# EasyEDA Pro project coildriver.eprj, board PCB1
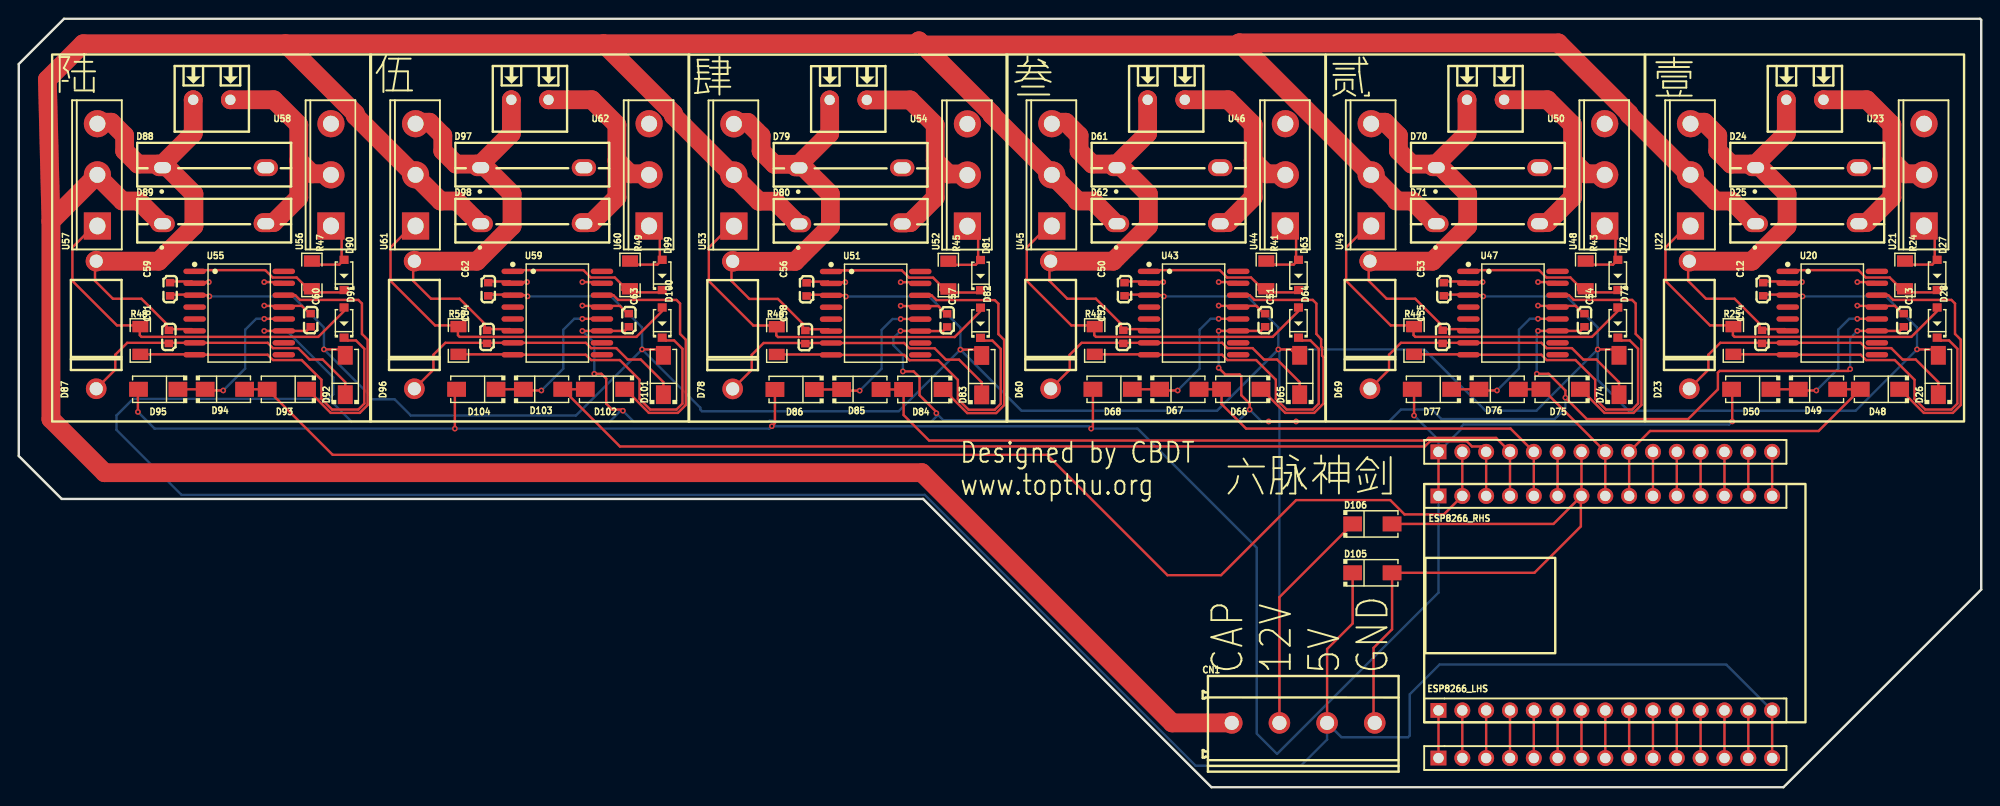
[diagram p2: board, top side]
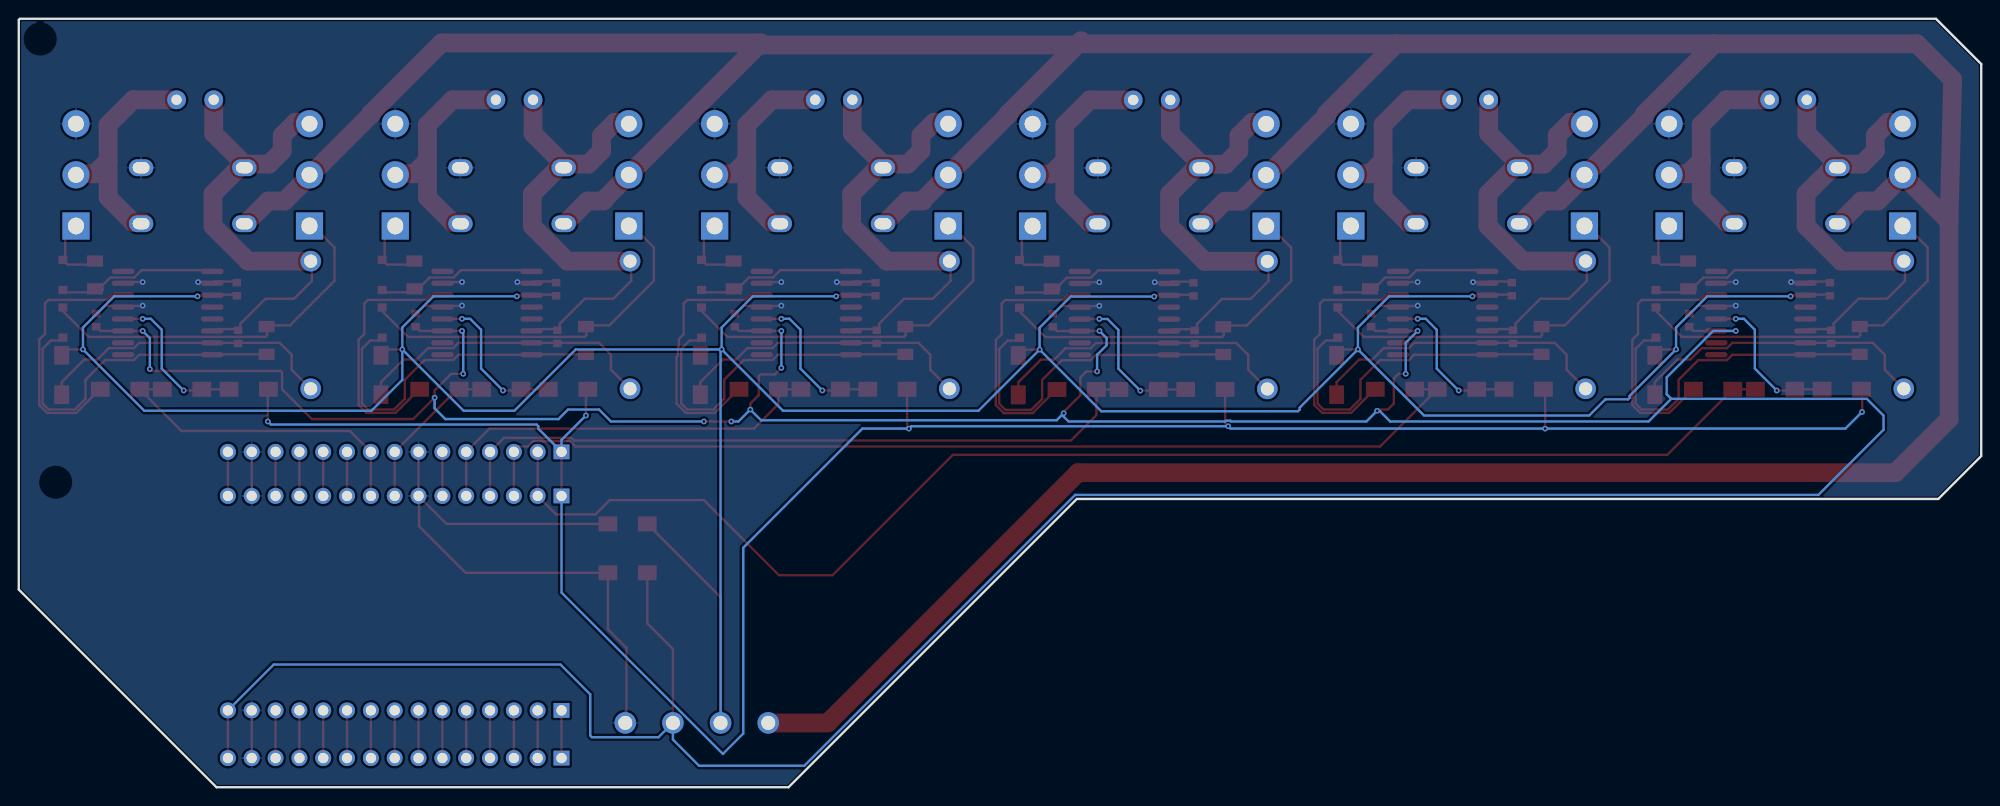
[diagram p3: board, bottom side, seen from below]

Outline 209.17 x 81.92 mm; copper layers: Top Layer, Bottom Layer. Coordinates in mm from the lower left corner of the outline.
Outline path: 0,77.09 0,35.31 4.57,30.73 96.39,30.73 127.13,0 188.09,0 209.17,21.08 209.17,81.79 209.04,81.92 4.83,81.92 0,77.09
Stack: Top Layer 0.035mm / Dielectric1 1.51mm FR4 er 4.5 / Bottom Layer 0.035mm

## Design rules (mm)
template: JLCPCB Capability(Two Layers Board)
spacing copperThickness1oz (default): track to track 0.102, other pairs 0.152 to 0.3
spacing copperThickness2oz: track to track 0.203, other pairs 0.152 to 0.3
track width copperThickness1oz (default): min 0.127, default 0.254, max 2.54
track width copperThickness2oz: min 0.203, default 0.254, max 2.54
differential pair differentialPair (default): width min 0.127, default 0.254, max 2.54; gap min 0.152, default 0.152
via viaSize (default): diameter min 0.5, default 0.61, max 10; hole min 0.3, default 0.305, max 6.3

## Placement (name value [footprint] x y rotation side)
C12  1uF  [C0603]  185.93 53.09 270 top
C13  1uF  [C0603]  200.91 49.78 270 top
C14  22uF  [C0603]  185.8 48.01 90 top
C50  1uF  [C0603]  117.86 53.09 270 top
C51  1uF  [C0603]  132.84 49.78 270 top
C52  22uF  [C0603]  117.73 48.01 90 top
C53  1uF  [C0603]  151.89 53.09 270 top
C54  1uF  [C0603]  166.88 49.78 270 top
C55  22uF  [C0603]  151.76 48.01 90 top
C56  1uF  [C0603]  83.97 53.07 270 top
C57  1uF  [C0603]  98.95 49.77 270 top
C58  22uF  [C0603]  83.84 47.99 90 top
C59  1uF  [C0603]  16.13 53.09 270 top
C60  1uF  [C0603]  31.12 49.78 270 top
C61  22uF  [C0603]  16 48.01 90 top
C62  1uF  [C0603]  50.04 53.09 270 top
C63  1uF  [C0603]  65.02 49.78 270 top
C64  22uF  [C0603]  49.91 48.01 90 top
CN1  DB128V-5.08-4P-GN-S  [CONN-TH_4P-P5.08_DIBO_DB128V-5.08]  136.91 6.86 0 top
D23  1N5355BG  [DO-201_BD5.3-L9.5-P13.50-D1.4-RD]  178.05 49.28 90 top
D24  VS-75EPU12L-N3  [TO-247-2_L15.8-W5.0-P10.92-L]  190.63 66.04 0 top
D25  VS-75EPU12L-N3  [TO-247-2_L15.8-W5.0-P10.92-L]  190.63 60.07 0 top
D26  1N4001  [SMA_L4.3-W2.5-LS5.0-RD]  204.6 43.94 90 top
D27  1N4148W  [SOD-123_L2.7-W1.6-LS3.7-FD]  204.47 54.61 270 top
D28  1N4148W  [SOD-123_L2.7-W1.6-LS3.7-FD]  204.47 49.53 270 top
D48  1N4001  [SMA_L4.3-W2.5-LS5.0-RD]  198.37 42.42 180 top
D49  1N4001  [SMA_L4.3-W2.5-LS5.0-RD]  191.77 42.42 0 top
D50  1N4001  [SMA_L4.3-W2.5-LS5.0-RD]  184.66 42.42 180 top
D60  1N5355BG  [DO-201_BD5.3-L9.5-P13.50-D1.4-RD]  109.98 49.28 90 top
D61  VS-75EPU12L-N3  [TO-247-2_L15.8-W5.0-P10.92-L]  122.55 66.04 0 top
D62  VS-75EPU12L-N3  [TO-247-2_L15.8-W5.0-P10.92-L]  122.55 60.07 0 top
D63  1N4148W  [SOD-123_L2.7-W1.6-LS3.7-FD]  136.4 54.61 270 top
D64  1N4148W  [SOD-123_L2.7-W1.6-LS3.7-FD]  136.4 49.53 270 top
D65  1N4001  [SMA_L4.3-W2.5-LS5.0-RD]  136.52 43.94 90 top
D66  1N4001  [SMA_L4.3-W2.5-LS5.0-RD]  130.3 42.42 180 top
D67  1N4001  [SMA_L4.3-W2.5-LS5.0-RD]  123.7 42.42 0 top
D68  1N4001  [SMA_L4.3-W2.5-LS5.0-RD]  116.59 42.42 180 top
D69  1N5355BG  [DO-201_BD5.3-L9.5-P13.50-D1.4-RD]  144.02 49.28 90 top
D70  VS-75EPU12L-N3  [TO-247-2_L15.8-W5.0-P10.92-L]  156.59 66.04 0 top
D71  VS-75EPU12L-N3  [TO-247-2_L15.8-W5.0-P10.92-L]  156.59 60.07 0 top
D72  1N4148W  [SOD-123_L2.7-W1.6-LS3.7-FD]  170.43 54.61 270 top
D73  1N4148W  [SOD-123_L2.7-W1.6-LS3.7-FD]  170.43 49.53 270 top
D74  1N4001  [SMA_L4.3-W2.5-LS5.0-RD]  170.56 43.94 90 top
D75  1N4001  [SMA_L4.3-W2.5-LS5.0-RD]  164.34 42.42 180 top
D76  1N4001  [SMA_L4.3-W2.5-LS5.0-RD]  157.73 42.42 0 top
D77  1N4001  [SMA_L4.3-W2.5-LS5.0-RD]  150.62 42.42 180 top
D78  1N5355BG  [DO-201_BD5.3-L9.5-P13.50-D1.4-RD]  76.09 49.26 90 top
D79  VS-75EPU12L-N3  [TO-247-2_L15.8-W5.0-P10.92-L]  88.66 66.02 0 top
D80  VS-75EPU12L-N3  [TO-247-2_L15.8-W5.0-P10.92-L]  88.66 60.05 0 top
D81  1N4148W  [SOD-123_L2.7-W1.6-LS3.7-FD]  102.51 54.59 270 top
D82  1N4148W  [SOD-123_L2.7-W1.6-LS3.7-FD]  102.51 49.51 270 top
D83  1N4001  [SMA_L4.3-W2.5-LS5.0-RD]  102.63 43.92 90 top
D84  1N4001  [SMA_L4.3-W2.5-LS5.0-RD]  96.41 42.4 180 top
D85  1N4001  [SMA_L4.3-W2.5-LS5.0-RD]  89.81 42.4 0 top
D86  1N4001  [SMA_L4.3-W2.5-LS5.0-RD]  82.7 42.4 180 top
D87  1N5355BG  [DO-201_BD5.3-L9.5-P13.50-D1.4-RD]  8.25 49.28 90 top
D88  VS-75EPU12L-N3  [TO-247-2_L15.8-W5.0-P10.92-L]  20.83 66.04 0 top
D89  VS-75EPU12L-N3  [TO-247-2_L15.8-W5.0-P10.92-L]  20.83 60.07 0 top
D90  1N4148W  [SOD-123_L2.7-W1.6-LS3.7-FD]  34.67 54.61 270 top
D91  1N4148W  [SOD-123_L2.7-W1.6-LS3.7-FD]  34.67 49.53 270 top
D92  1N4001  [SMA_L4.3-W2.5-LS5.0-RD]  34.8 43.94 90 top
D93  1N4001  [SMA_L4.3-W2.5-LS5.0-RD]  28.57 42.42 180 top
D94  1N4001  [SMA_L4.3-W2.5-LS5.0-RD]  21.97 42.42 0 top
D95  1N4001  [SMA_L4.3-W2.5-LS5.0-RD]  14.86 42.42 180 top
D96  1N5355BG  [DO-201_BD5.3-L9.5-P13.50-D1.4-RD]  42.16 49.28 90 top
D97  VS-75EPU12L-N3  [TO-247-2_L15.8-W5.0-P10.92-L]  54.74 66.04 0 top
D98  VS-75EPU12L-N3  [TO-247-2_L15.8-W5.0-P10.92-L]  54.74 60.07 0 top
D99  1N4148W  [SOD-123_L2.7-W1.6-LS3.7-FD]  68.58 54.61 270 top
D100  1N4148W  [SOD-123_L2.7-W1.6-LS3.7-FD]  68.58 49.53 270 top
D101  1N4001  [SMA_L4.3-W2.5-LS5.0-RD]  68.71 43.94 90 top
D102  1N4001  [SMA_L4.3-W2.5-LS5.0-RD]  62.48 42.42 180 top
D103  1N4001  [SMA_L4.3-W2.5-LS5.0-RD]  55.88 42.42 0 top
D104  1N4001  [SMA_L4.3-W2.5-LS5.0-RD]  48.77 42.42 180 top
D105  1N4001  [SMA_L4.3-W2.5-LS5.0-RD]  144.27 22.86 0 top
D106  1N4001  [SMA_L4.3-W2.5-LS5.0-RD]  144.27 28.07 0 top
ESP8266_LHS  KH-2.54FH-1X15P-H8.5  [HDR-TH_15P-P2.54-V-F]  169.1 8.19 0 top
ESP8266_LHS1  KH-2.54FH-1X15P-H8.5  [HDR-TH_15P-P2.54-V-F]  169.1 3.11 0 top
ESP8266_RHS  KH-2.54FH-1X15P-H8.5  [HDR-TH_15P-P2.54-V-F]  169.1 31.05 0 top
ESP8266_RHS1  KH-2.54FH-1X15P-H8.5  [HDR-TH_15P-P2.54-V-F]  169.1 35.75 0 top
R24  5.1Ω  [R1206]  201.04 54.61 270 top
R25  5.1Ω  [R1206]  182.75 47.62 270 top
R41  5.1Ω  [R1206]  132.97 54.61 270 top
R42  5.1Ω  [R1206]  114.68 47.62 270 top
R43  5.1Ω  [R1206]  167 54.61 270 top
R44  5.1Ω  [R1206]  148.72 47.62 270 top
R45  5.1Ω  [R1206]  99.08 54.59 270 top
R46  5.1Ω  [R1206]  80.79 47.61 270 top
R47  5.1Ω  [R1206]  31.24 54.61 270 top
R48  5.1Ω  [R1206]  12.95 47.62 270 top
R49  5.1Ω  [R1206]  65.15 54.61 270 top
R50  5.1Ω  [R1206]  46.86 47.62 270 top
U20  IR2110SPBF  [SOIC-16_L10.3-W7.5-P1.27-LS10.3-BL]  193.29 50.55 270 top
U21  AUIRGPS4067D1  [SUPER-247_L15.6-W5.0-P5.45-L]  203.07 65.28 90 top
U22  AUIRGPS4067D1  [SUPER-247_L15.6-W5.0-P5.45-L]  178.18 65.28 90 top
U23  WJ350V-3.96-2P-14-00A  [CONN-TH_2P-P3.96_WJ350V-3.96-2P-14-00A]  190.37 73.28 180 top
U43  IR2110SPBF  [SOIC-16_L10.3-W7.5-P1.27-LS10.3-BL]  125.22 50.55 270 top
U44  AUIRGPS4067D1  [SUPER-247_L15.6-W5.0-P5.45-L]  135 65.28 90 top
U45  AUIRGPS4067D1  [SUPER-247_L15.6-W5.0-P5.45-L]  110.11 65.28 90 top
U46  WJ350V-3.96-2P-14-00A  [CONN-TH_2P-P3.96_WJ350V-3.96-2P-14-00A]  122.3 73.28 180 top
U47  IR2110SPBF  [SOIC-16_L10.3-W7.5-P1.27-LS10.3-BL]  159.26 50.55 270 top
U48  AUIRGPS4067D1  [SUPER-247_L15.6-W5.0-P5.45-L]  169.04 65.28 90 top
U49  AUIRGPS4067D1  [SUPER-247_L15.6-W5.0-P5.45-L]  144.14 65.28 90 top
U50  WJ350V-3.96-2P-14-00A  [CONN-TH_2P-P3.96_WJ350V-3.96-2P-14-00A]  156.34 73.28 180 top
U51  IR2110SPBF  [SOIC-16_L10.3-W7.5-P1.27-LS10.3-BL]  91.33 50.53 270 top
U52  AUIRGPS4067D1  [SUPER-247_L15.6-W5.0-P5.45-L]  101.11 65.26 90 top
U53  AUIRGPS4067D1  [SUPER-247_L15.6-W5.0-P5.45-L]  76.22 65.26 90 top
U54  WJ350V-3.96-2P-14-00A  [CONN-TH_2P-P3.96_WJ350V-3.96-2P-14-00A]  88.41 73.26 180 top
U55  IR2110SPBF  [SOIC-16_L10.3-W7.5-P1.27-LS10.3-BL]  23.49 50.55 270 top
U56  AUIRGPS4067D1  [SUPER-247_L15.6-W5.0-P5.45-L]  33.27 65.28 90 top
U57  AUIRGPS4067D1  [SUPER-247_L15.6-W5.0-P5.45-L]  8.38 65.28 90 top
U58  WJ350V-3.96-2P-14-00A  [CONN-TH_2P-P3.96_WJ350V-3.96-2P-14-00A]  20.57 73.28 180 top
U59  IR2110SPBF  [SOIC-16_L10.3-W7.5-P1.27-LS10.3-BL]  57.4 50.55 270 top
U60  AUIRGPS4067D1  [SUPER-247_L15.6-W5.0-P5.45-L]  67.18 65.28 90 top
U61  AUIRGPS4067D1  [SUPER-247_L15.6-W5.0-P5.45-L]  42.29 65.28 90 top
U62  WJ350V-3.96-2P-14-00A  [CONN-TH_2P-P3.96_WJ350V-3.96-2P-14-00A]  54.48 73.28 180 top

## Footprints (pads in the part's own frame, mm; a bottom-side part is the same pattern mirrored in y, then rotated)
C0603
  rect 0.8x0.9 smd: 1(-0.7,0) 2(0.7,0)
CONN-TH_2P-P3.96_WJ350V-3.96-2P-14-00A
  round 2 hole 1.1: 1(-1.98,0) 2(1.98,0)
CONN-TH_4P-P5.08_DIBO_DB128V-5.08
  round 2.3 hole 1.5: 1(-7.62,0) 2(-2.54,0) 3(2.54,0) 4(7.62,0)
DO-201_BD5.3-L9.5-P13.50-D1.4-RD
  round 2.2 hole 1.4: 1(-6.8,0) 2(6.8,0)
HDR-TH_15P-P2.54-V-F
  rect 1.7x1.575 hole 1.1: 1(-17.78,0)
  round 1.7 hole 1.1: 2(-15.24,0) 3(-12.7,0) 4(-10.16,0) 5(-7.62,0) 6(-5.08,0) 7(-2.54,0) 8(0,0) 9(2.54,0) 10(5.08,0) 11(7.62,0) 12(10.16,0) 13(12.7,0) 14(15.24,0) 15(17.78,0)
R1206
  rect 1.208x1.701 smd: 1(-1.479,0) 2(1.479,0)
SMA_L4.3-W2.5-LS5.0-RD
  rect 2x1.593 smd: 1(-2.1,0) 2(2.1,0)
SOD-123_L2.7-W1.6-LS3.7-FD
  rect 0.88x0.96 smd: 1(-1.61,0) 2(1.61,0)
SOIC-16_L10.3-W7.5-P1.27-LS10.3-BL
  oval 0.574x2.401 smd: 1(-4.445,-4.75) 2(-3.175,-4.75) 3(-1.905,-4.75) 4(-0.635,-4.75) 5(0.635,-4.75) 6(1.905,-4.75) 7(3.175,-4.75) 8(4.445,-4.75) 9(4.445,4.75) 10(3.175,4.75) 11(1.905,4.75) 12(0.635,4.75) 13(-0.635,4.75) 14(-1.905,4.75) 15(-3.175,4.75) 16(-4.445,4.75)
SUPER-247_L15.6-W5.0-P5.45-L
  rect 2.9x2.9 hole 1.785x1.7: 1(-5.45,0)
  round 2.9 hole 1.7: 2(0,0) 3(5.45,0)
TO-247-2_L15.8-W5.0-P10.92-L
  oval 2.6x1.8 hole 1.8x1.2: 1(-5.5,0) 3(5.5,0)

## Nets
As in the schematic.

Pads without a net: U20 4 5 9 10 16; U43 4 5 9 10 16; U47 4 5 9 10 16; U51 4 5 9 10 16; U55 4 5 9 10 16; U59 4 5 9 10 16

## Via types
v1: diameter 0.61, hole 0.305, Top Layer to Bottom Layer, 65 vias

## Routing (per net, layer and track width the routed paths; a pad name or vN(x,y) marks a point on that pad's centre or on a via; arc(x,y) is an arc through that point)
12V: length 400.1
  Top Layer w0.254: 52.4,52.58 52.33,52.51 49.78,52.51 ; U43.3 121.92,52.45 v1(122.05,52.32) ; D101.2 68.08,46.67 v1(66.43,46.67) ; v1(54.23,52.32) 54.1,52.45 U59.3 ; 120.22,52.58 120.15,52.51 117.6,52.51 ; v1(100.36,46.65) 102.01,46.65 D83.2 ; v1(168.29,46.67) 169.94,46.67 D74.2 ; 188.29,52.58 188.22,52.51 185.67,52.51 ; U47.3 155.96,52.45 v1(156.08,52.32) ; v1(134.25,46.67) 135.64,46.67 135.64,46.61 136.2,46.04 D65.2 ; 83.71,52.5 86.26,52.5 86.33,52.56 ; v1(32.52,46.67) 34.17,46.67 D92.2 ; U20.3 189.99,52.45 v1(190.12,52.32) ; 15.87,52.51 18.43,52.51 18.49,52.58 ; 151.64,52.51 154.19,52.51 154.25,52.58 ; U55.3 20.19,52.45 v1(20.32,52.32) ; D26.2 203.97,46.67 v1(202.32,46.67) ; U51.3 88.03,52.43 v1(88.16,52.31) ; CN1.2 134.37,20.26 D106.1
  Bottom Layer w0.254: v1(88.16,52.31) 97.05,52.31 100.36,48.99 v1(100.36,46.65) ; v1(134.25,46.67) 149.8,46.67 156.34,40.13 161.75,40.13 v1(168.29,46.67) ; v1(134.25,46.67) 134.37,46.55 CN1.2 ; v1(134.25,46.67) 127.72,40.13 106.88,40.13 v1(100.36,46.65) ; v1(134.25,46.67) 134.25,49.01 130.94,52.32 v1(122.05,52.32) ; v1(66.43,46.67) 72.64,40.46 72.64,40.26 72.82,40.08 93.79,40.08 v1(100.36,46.65) ; v1(66.43,46.67) 59.39,39.62 41.78,39.62 40.06,41.35 37.64,41.35 37.46,41.53 37.46,41.73 v1(32.52,46.67) 32.52,49.01 29.21,52.32 v1(20.32,52.32) ; v1(66.43,46.67) 66.43,49.01 63.12,52.32 v1(54.23,52.32) ; v1(156.08,52.32) 164.97,52.32 168.29,49.01 v1(168.29,46.67) ; v1(190.12,52.32) 199.01,52.32 202.32,49.01 v1(202.32,46.67) 195.79,40.13 171.58,40.13 168.29,43.42 v1(168.29,46.67)
+5V: length 512.5
  Top Layer w0.254: v1(61.34,44.07) 62.1,44.07 62.61,43.56 62.61,40.89 63.25,40.26 64.26,40.26 v1(64.39,40.13) ; v1(161.8,44.07) 163.07,44.07 164.85,42.29 v1(164.85,41.53) 167.13,39.24 177.93,39.24 181.1,42.42 181.1,44.2 181.28,44.38 195,44.38 v1(195.2,44.58) ; C54.2 166.44,48.64 U47.11 v1(161.92,48.64) ; v1(93.98,48.64) 96.06,48.64 U51.11 98.51,48.62 C57.2 ; v1(60.07,48.64) U59.11 64.58,48.64 C63.2 ; v1(127.89,44.7) 128.6,43.99 130.12,43.99 130.3,43.81 130.3,41.78 131.19,40.89 v1(131.19,40.26) ; v1(127.89,48.64) U43.11 132.4,48.64 C51.2 ; v1(94.23,44.32) 95.38,44.32 96.01,43.69 96.01,41.78 97.8,39.99 v1(97.8,39.87) ; v1(195.96,48.64) U20.11 200.47,48.64 C13.2 ; C60.2 30.67,48.64 U55.11 v1(26.16,48.64) ; v1(133.22,38.99) v1(136.14,38.99) ; D105.1 142.17,17.46 139.45,14.73 CN1.3 ; ESP8266_LHS1.15 ESP8266_LHS.15
  Bottom Layer w0.254: v1(60.07,48.64) 61.34,47.37 v1(61.34,44.07) ; v1(164.85,41.53) 164.85,40.39 163.7,39.24 151.64,39.24 150.62,40.26 147.32,40.26 146.05,38.99 v1(136.14,38.99) ; v1(195.2,44.58) 195.2,47.88 v1(195.96,48.64) ; 33.04,41.4 33.53,41.89 33.53,43.69 28.57,48.64 v1(26.16,48.64) ; 33.04,41.4 35.45,38.99 62.99,38.99 64.13,40.13 v1(64.39,40.13) 65.53,38.99 79.95,38.99 80.02,39.06 80.51,39.06 80.58,38.99 97.28,38.99 97.85,39.56 97.85,39.81 ; 33.04,41.4 12.19,41.4 10.41,39.62 10.41,38.1 17.35,31.16 96.57,31.16 125.44,2.29 136.65,2.29 139.45,5.08 CN1.3 140.97,5.33 148.08,5.33 148.26,5.51 148.26,9.91 151.44,13.08 181.99,13.08 ESP8266_LHS.15 ; v1(127.89,44.7) v1(127.89,48.64) ; v1(93.98,48.64) 93.22,47.88 93.22,47.12 94.23,46.1 v1(94.23,44.32) ; 97.85,39.81 98.55,39.12 130.05,39.12 v1(131.19,40.26) 132.46,38.99 v1(133.22,38.99) ; 97.85,39.81 v1(97.8,39.87) ; v1(161.8,44.07) 161.8,48.51 v1(161.92,48.64)
GND: length 145.6
  Top Layer w0.254: 15.87,53.91 18.43,53.91 18.49,53.85 v1(20.26,53.85) ; v1(190.06,53.85) 188.29,53.85 188.22,53.91 185.67,53.91 ; 117.6,53.91 120.15,53.91 120.22,53.85 v1(121.99,53.85) ; 151.64,53.91 154.19,53.91 154.25,53.85 v1(156.02,53.85) ; 200.66,50.61 199.96,51.31 195.99,51.31 v1(195.96,51.34) ; 166.5,30.99 166.5,27.81 161.54,22.86 D105.2 146.37,16.83 144.4,14.86 144.4,6.99 CN1.4 ; 166.5,30.99 163.58,28.07 D106.2 ; 166.5,30.99 ESP8266_RHS.7 ESP8266_RHS1.7 ; v1(26.16,53.85) 27.99,53.85 ; 166.62,50.61 165.93,51.31 161.96,51.31 v1(161.92,51.34) ; ESP8266_RHS.14 ESP8266_RHS1.14 ; 98.7,50.59 98,51.29 94.03,51.29 v1(94,51.32) ; v1(26.16,51.34) 26.19,51.31 30.16,51.31 30.86,50.61 ; 132.59,50.61 131.89,51.31 127.92,51.31 v1(127.89,51.34) ; v1(127.89,53.85) 129.72,53.85 ; v1(161.92,53.85) 163.75,53.85 ; 64.77,50.61 64.07,51.31 60.1,51.31 v1(60.07,51.34) ; v1(88.1,53.83) 86.33,53.83 86.26,53.9 83.71,53.9 ; 49.78,53.91 52.33,53.91 52.4,53.85 v1(54.17,53.85) ; v1(94,53.83) 95.83,53.83 ; ESP8266_LHS.14 ESP8266_LHS1.14 ; v1(60.07,53.85) 61.9,53.85 ; v1(195.96,53.85) 197.79,53.85
CAP: length 497.6
  Top Layer w1.999: 62.34,79.25 69.78,71.81 69.78,71.57 78.89,62.47 80.62,62.47 82.91,60.18 ; 62.34,79.25 95.63,79.25 95.94,79.56 96.38,79.12 ; 62.34,79.25 28.43,79.25 ; 96.38,79.12 103.71,71.79 103.71,71.67 U45.2 112.84,62.55 ; 96.38,79.12 129.87,79.12 130.08,79.34 ; 28.43,79.25 35.88,71.81 35.88,71.57 44.96,62.48 46.7,62.48 48.98,60.2 ; 28.43,79.25 6.86,79.25 3.05,75.44 3.43,60.33 ; 3.43,60.33 3.43,39.24 9.14,33.53 96.27,33.53 122.94,6.86 CN1.1 ; 3.43,60.33 8.32,65.21 ; 8.32,65.21 8.13,65.41 ; 8.32,65.21 11.05,62.48 12.79,62.48 15.07,60.2 ; 8.32,65.21 U57.2 ; 130.08,79.34 164.1,79.34 171.64,71.81 171.64,71.69 180.85,62.48 182.59,62.48 184.87,60.2 ; 130.08,79.34 U49.2 146.88,62.55 ; 112.78,62.48 114.51,62.48 116.8,60.2 ; 146.81,62.48 148.55,62.48 150.84,60.2
CTRL1: length 34.5
  Top Layer w0.254: D49.2 D48.2 191.83,37.97 173.86,37.97 ESP8266_RHS1.9 ESP8266_RHS.9
CTRL2: length 16.7
  Top Layer w0.254: D76.2 D75.2 162.43,42.42 ESP8266_RHS1.8 ESP8266_RHS.8
CTRL3: length 44.1
  Top Layer w0.254: ESP8266_RHS.5 ESP8266_RHS1.5 159,38.23 130.81,38.23 128.2,40.84 D66.2 D67.2
CTRL4: length 76.3
  Top Layer w0.254: ESP8266_RHS.4 ESP8266_RHS1.4 157.46,37.24 150.27,37.24 149.99,36.96 97.03,36.96 94.31,39.67 D84.2 91.91,42.4
CTRL5: length 108.7
  Top Layer w0.254: ESP8266_RHS.3 ESP8266_RHS1.3 155.83,36.32 154.89,36.32 154.33,36.88 150.42,36.88 149.86,36.32 64.08,36.32 D103.2 D102.2
CTRL6: length 147.5
  Top Layer w0.254: D94.2 D93.2 33.46,35.43 109.6,35.43 122.43,22.61 128.14,22.61 136.14,30.61 146.18,30.61 147.7,29.08 151.89,29.08 ESP8266_RHS.2 ESP8266_RHS1.2
INIT: length 246.8
  Top Layer w0.254: D50.2 182.63,42.35 v1(182.63,38.99) ; v1(114.3,38.23) 114.49,38.41 D68.2 ; ESP8266_RHS.1 ESP8266_RHS1.1 ; D86.2 80.6,38.81 v1(80.26,38.48) ; D77.2 148.72,42.22 v1(148.72,39.62) ; D95.2 12.7,42.36 v1(12.7,40.01) ; v1(46.48,38.23) 46.48,42.23 D104.2
  Bottom Layer w0.254: ESP8266_RHS.1 151.32,20.75 134.12,3.55 131.95,5.72 131.95,25.53 119.25,38.23 v1(114.3,38.23) 114.05,38.48 v1(80.26,38.48) 80.01,38.23 v1(46.48,38.23) 14.48,38.23 v1(12.7,40.01) ; v1(182.63,38.99) 182.3,38.66 153.98,38.66 153.8,38.48 153.8,38.23 ESP8266_RHS1.1 151.32,37.02 v1(148.72,39.62)
$1N13206: length 24.8
  Top Layer w1.999: 199.64,66.8 201.06,65.39 202.82,65.39 ; 199.64,66.8 199.64,70.61 196.98,73.28 U23.1 ; 199.64,66.8 199.64,62.87 196.98,60.2 195.87,60.2
$1N13207: length 27.7
  Top Layer w0.254: U20.14 199.26,52.45 199.77,51.94 205.99,51.94 206.38,51.56 206.38,48.32 206.98,47.71 206.98,40.75 206.14,39.9 203.05,39.9 200.54,42.42 D48.1
$1N13208: length 16.9
  Top Layer w0.254: D50.1 D49.1 189.8,42.29 v1(191.59,42.29) ; v1(195.96,49.93) 198.02,49.93 U20.12
  Bottom Layer w0.254: v1(195.96,49.93) 195.09,49.93 193.93,48.77 193.93,44.63 v1(191.59,42.29)
$1N13209: length 36.3
  Top Layer w0.254: R25.2 188.5,46.15 U20.8 196.33,46.1 196.9,45.53 199.96,45.53 202.06,43.43 202.06,41.4 203.2,40.26 205.99,40.26 206.63,40.89 206.63,46.74 205.74,47.62 204.89,47.62 204.47,48.05
$1N13210: length 40
  Top Layer w0.254: 177.93,59.95 175.51,57.54 175.51,53.98 180.26,49.23 182.5,49.23 182.7,49.03 182.7,48.19 182.88,48.01 201.72,48.01 204.47,50.76
$1N13211: length 17.2
  Top Layer w0.254: 204.22,52.75 204.21,52.75 200.49,52.75 200.23,53 200.23,53.51 199.41,54.33 196.86,54.33 196.08,55.12 188.29,55.12
$1N13212: length 8.4
  Top Layer w0.254: 200.53,55.71 203.96,55.71 204.22,55.97 204.22,58.56 202.82,59.95
$1N30415: length 53.7
  Top Layer w0.254: 188.29,48.77 188.22,48.83 185.55,48.83 185.55,49.4 182.88,52.07 179.83,52.07 177.93,53.98 177.93,56.08
  Top Layer w1.999: 184.87,66.17 188.39,69.69 U23.2 ; 184.87,66.17 184.62,66.42 182.5,66.42 181.09,67.83 181.09,69.47 179.67,70.88 177.95,70.88 177.93,70.86 ; 184.87,66.17 185.55,66.17 188.47,63.25 188.47,59.82 184.73,56.08 177.93,56.08
$1N30437: length 32.6
  Top Layer w0.254: 204.6,41.84 204.6,43.18 202.18,45.59 200.79,45.59 199.57,46.81 196.9,46.81 196.33,47.37 U20.7 181.36,47.37 180.09,46.1 180.09,44.51 D23.1
$1N32363: length 36.3
  Top Layer w0.254: R42.2 120.43,46.15 U43.8 128.26,46.1 128.82,45.53 131.88,45.53 133.98,43.43 133.98,41.4 135.13,40.26 137.92,40.26 138.56,40.89 138.56,46.74 137.67,47.62 136.82,47.62 136.4,48.05
$1N32364: length 32.6
  Top Layer w0.254: 136.52,41.84 136.52,43.18 134.11,45.59 132.72,45.59 131.5,46.81 128.82,46.81 128.26,47.37 U43.7 113.28,47.37 112.01,46.1 112.01,44.51 D60.1
$1N32374: length 53.7
  Top Layer w0.254: 109.85,56.08 109.85,53.98 111.76,52.07 114.81,52.07 117.47,49.4 117.47,48.83 120.15,48.83 120.22,48.77
  Top Layer w1.999: U46.2 120.32,69.69 116.8,66.17 ; 109.85,56.08 116.66,56.08 120.4,59.82 120.4,63.25 117.47,66.17 116.8,66.17 ; 116.8,66.17 116.55,66.42 114.43,66.42 113.01,67.83 113.01,69.47 111.6,70.88 109.88,70.88 109.85,70.86
$1N32395: length 27.8
  Top Layer w0.254: D66.1 132.47,42.42 134.98,39.9 138.07,39.9 139.06,40.9 139.06,45.85 138.91,46 138.91,46.88 138.81,46.99 138.81,47.75 138.3,48.32 138.3,51.56 137.92,51.94 131.7,51.94 131.19,52.45 U43.14
$1N32396: length 16.9
  Top Layer w0.254: v1(123.52,42.29) 121.72,42.29 D67.1 D68.1 ; v1(127.89,49.93) 129.95,49.93 U43.12
  Bottom Layer w0.254: v1(127.89,49.93) 127.02,49.93 125.86,48.77 125.86,44.63 v1(123.52,42.29)
$1N32406: length 17.2
  Top Layer w0.254: 136.14,52.75 136.14,52.75 132.42,52.75 132.16,53 132.16,53.51 131.34,54.33 128.79,54.33 128,55.12 120.22,55.12
$1N32408: length 8.4
  Top Layer w0.254: 134.75,59.95 136.14,58.56 136.14,55.97 135.89,55.71 132.46,55.71
$1N32409: length 24.8
  Top Layer w1.999: 131.57,66.8 131.57,62.87 128.91,60.2 127.8,60.2 ; 131.57,66.8 132.99,65.39 134.75,65.39 ; 131.57,66.8 131.57,70.61 128.91,73.28 U46.1
$1N32412: length 40
  Top Layer w0.254: 109.85,59.95 107.44,57.54 107.44,53.98 112.19,49.23 114.43,49.23 114.63,49.03 114.63,48.19 114.81,48.01 133.64,48.01 136.4,50.76
$1N33221: length 36.3
  Top Layer w0.254: 170.43,48.05 170.86,47.62 171.7,47.62 172.59,46.74 172.59,40.89 171.96,40.26 169.16,40.26 168.02,41.4 168.02,43.43 165.92,45.53 162.86,45.53 162.29,46.1 U47.8 154.46,46.15 R44.2
$1N33222: length 32.6
  Top Layer w0.254: 170.56,41.84 170.56,43.18 168.15,45.59 166.75,45.59 165.54,46.81 162.86,46.81 162.29,47.37 U47.7 147.32,47.37 146.05,46.1 146.05,44.51 D69.1
$1N33232: length 53.7
  Top Layer w0.254: 143.89,56.08 143.89,53.98 145.8,52.07 148.84,52.07 151.51,49.4 151.51,48.83 154.19,48.83 154.25,48.77
  Top Layer w1.999: 143.89,70.86 143.92,70.88 145.64,70.88 147.05,69.47 147.05,67.83 148.46,66.42 150.58,66.42 150.84,66.17 ; 150.84,66.17 154.36,69.69 U50.2 ; 150.84,66.17 151.51,66.17 154.43,63.25 154.43,59.82 150.69,56.08 143.89,56.08
$1N33253: length 27.7
  Top Layer w0.254: D75.1 166.5,42.42 169.02,39.9 172.11,39.9 172.95,40.75 172.95,47.71 172.34,48.32 172.34,51.56 171.96,51.94 165.73,51.94 165.23,52.45 U47.14
$1N33254: length 16.9
  Top Layer w0.254: v1(157.56,42.29) 155.76,42.29 D76.1 D77.1 ; U47.12 163.99,49.93 v1(161.92,49.93)
  Bottom Layer w0.254: v1(161.92,49.93) 161.06,49.93 159.89,48.77 159.89,44.63 v1(157.56,42.29)
$1N33264: length 17.2
  Top Layer w0.254: 154.25,55.12 162.04,55.12 162.83,54.33 165.38,54.33 166.2,53.51 166.2,53 166.45,52.75 170.18,52.75 170.18,52.75
$1N33266: length 8.4
  Top Layer w0.254: 166.5,55.71 169.92,55.71 170.18,55.97 170.18,58.56 168.78,59.95
$1N33267: length 24.8
  Top Layer w1.999: 168.78,65.39 167.02,65.39 165.61,66.8 ; 165.61,66.8 165.61,62.87 162.94,60.2 161.84,60.2 ; 165.61,66.8 165.61,70.61 162.94,73.28 U50.1
$1N33270: length 40
  Top Layer w0.254: 143.89,59.95 141.48,57.54 141.48,53.98 146.22,49.23 148.46,49.23 148.66,49.03 148.66,48.19 148.84,48.01 167.68,48.01 170.43,50.76
$1N36530: length 24.8
  Top Layer w1.999: 97.68,66.78 99.09,65.37 100.86,65.37 ; 97.68,66.78 97.68,70.59 95.01,73.26 U54.1 ; 97.68,66.78 97.68,62.85 95.01,60.18 93.91,60.18
$1N36531: length 27.7
  Top Layer w0.254: 98.51,42.4 98.57,42.4 101.09,39.89 104.18,39.89 105.02,40.73 105.02,47.69 104.41,48.3 104.41,51.54 104.03,51.93 97.81,51.93 97.3,52.43 U51.14
$1N36532: length 16.9
  Top Layer w0.254: 84.8,42.4 D85.1 87.83,42.27 v1(89.63,42.27) ; v1(94,49.92) 96.06,49.92 U51.12
  Bottom Layer w0.254: v1(89.63,42.27) 91.97,44.61 91.97,48.75 93.13,49.92 v1(94,49.92)
$1N36535: length 36.3
  Top Layer w0.254: 102.51,48.03 102.93,47.61 103.78,47.61 104.67,46.72 104.67,40.88 104.03,40.24 101.24,40.24 100.09,41.38 100.09,43.42 97.99,45.52 94.93,45.52 94.37,46.08 U51.8 86.54,46.13 R46.2
$1N36536: length 40
  Top Layer w0.254: 102.51,50.74 99.75,47.99 80.92,47.99 80.74,48.17 80.74,49.01 80.54,49.21 78.3,49.21 73.55,53.96 73.55,57.52 75.96,59.94
$1N36537: length 17.2
  Top Layer w0.254: 86.33,55.1 94.11,55.1 94.9,54.31 97.45,54.31 98.27,53.5 98.27,52.99 98.53,52.73 102.25,52.73 102.25,52.73
$1N36538: length 8.4
  Top Layer w0.254: 98.57,55.69 102,55.69 102.25,55.95 102.25,58.54 100.86,59.94
$1N36559: length 32.6
  Top Layer w0.254: D78.1 78.12,44.49 78.12,46.08 79.39,47.35 U51.7 94.37,47.35 94.93,46.79 97.61,46.79 98.82,45.58 100.22,45.58 102.63,43.16 D83.1
$1N36580: length 24.8
  Top Layer w1.999: 29.84,66.8 29.84,62.87 27.18,60.2 26.07,60.2 ; 29.84,66.8 31.26,65.39 33.02,65.39 ; 29.84,66.8 29.84,70.61 27.18,73.28 U58.1
$1N36581: length 27.7
  Top Layer w0.254: U55.14 29.46,52.45 29.97,51.94 36.2,51.94 36.58,51.56 36.58,48.32 37.19,47.71 37.19,40.75 36.34,39.9 33.25,39.9 30.74,42.42 D93.1
$1N36582: length 16.9
  Top Layer w0.254: v1(21.79,42.29) 20,42.29 D94.1 D95.1 ; U55.12 28.22,49.93 v1(26.16,49.93)
  Bottom Layer w0.254: v1(26.16,49.93) 25.29,49.93 24.13,48.77 24.13,44.63 v1(21.79,42.29)
$1N36585: length 36.3
  Top Layer w0.254: 34.67,48.05 35.09,47.62 35.94,47.62 36.83,46.74 36.83,40.89 36.2,40.26 33.4,40.26 32.26,41.4 32.26,43.43 30.16,45.53 27.1,45.53 26.53,46.1 U55.8 18.7,46.15 R48.2
$1N36586: length 40
  Top Layer w0.254: 8.13,59.95 5.71,57.54 5.71,53.98 10.46,49.23 12.7,49.23 12.9,49.03 12.9,48.19 13.08,48.01 31.92,48.01 34.67,50.76
$1N36587: length 17.2
  Top Layer w0.254: 34.42,52.75 34.41,52.75 30.69,52.75 30.43,53 30.43,53.51 29.61,54.33 27.06,54.33 26.28,55.12 18.49,55.12
$1N36588: length 8.4
  Top Layer w0.254: 33.02,59.95 34.42,58.56 34.42,55.97 34.16,55.71 30.73,55.71
$1N36595: length 53.7
  Top Layer w0.254: 8.13,56.08 8.13,53.98 10.03,52.07 13.08,52.07 15.75,49.4 15.75,48.83 18.43,48.83 18.49,48.77
  Top Layer w1.999: 15.07,66.17 15.75,66.17 18.67,63.25 18.67,59.82 14.93,56.08 8.13,56.08 ; 15.07,66.17 14.82,66.42 12.7,66.42 11.29,67.83 11.29,69.47 9.87,70.88 8.16,70.88 8.13,70.86 ; 15.07,66.17 18.59,69.69 U58.2
$1N36609: length 32.6
  Top Layer w0.254: D87.1 10.29,44.51 10.29,46.1 11.56,47.37 U55.7 26.53,47.37 27.1,46.81 29.78,46.81 30.99,45.59 32.38,45.59 34.8,43.18 34.8,41.84
$1N36630: length 24.8
  Top Layer w1.999: 66.93,65.39 65.17,65.39 63.75,66.8 ; 63.75,66.8 63.75,62.87 61.09,60.2 59.98,60.2 ; 63.75,66.8 63.75,70.61 61.09,73.28 U62.1
$1N36631: length 27.7
  Top Layer w0.254: D102.1 64.65,42.42 67.16,39.9 70.25,39.9 71.09,40.75 71.09,47.71 70.48,48.32 70.48,51.56 70.1,51.94 63.88,51.94 63.37,52.45 U59.14
$1N36632: length 16.9
  Top Layer w0.254: 50.87,42.42 D103.1 53.91,42.29 v1(55.7,42.29) ; U59.12 62.13,49.93 v1(60.07,49.93)
  Bottom Layer w0.254: v1(60.07,49.93) 59.2,49.93 58.04,48.77 58.04,44.63 v1(55.7,42.29)
$1N36635: length 36.3
  Top Layer w0.254: R50.2 52.61,46.15 U59.8 60.44,46.1 61.01,45.53 64.07,45.53 66.17,43.43 66.17,41.4 67.31,40.26 70.1,40.26 70.74,40.89 70.74,46.74 69.85,47.62 69,47.62 68.58,48.05
$1N36636: length 40
  Top Layer w0.254: 42.04,59.95 39.62,57.54 39.62,53.98 44.37,49.23 46.61,49.23 46.81,49.03 46.81,48.19 46.99,48.01 65.83,48.01 68.58,50.76
$1N36637: length 17.2
  Top Layer w0.254: 68.33,52.75 68.32,52.75 64.6,52.75 64.34,53 64.34,53.51 63.52,54.33 60.97,54.33 60.19,55.12 52.4,55.12
$1N36638: length 8.4
  Top Layer w0.254: 64.64,55.71 68.07,55.71 68.33,55.97 68.33,58.56 66.93,59.95
$1N36645: length 53.7
  Top Layer w0.254: 42.04,56.08 42.04,53.98 43.94,52.07 46.99,52.07 49.66,49.4 49.66,48.83 52.33,48.83 52.4,48.77
  Top Layer w1.999: 48.98,66.17 49.66,66.17 52.58,63.25 52.58,59.82 48.84,56.08 42.04,56.08 ; 48.98,66.17 48.73,66.42 46.61,66.42 45.2,67.83 45.2,69.47 43.78,70.88 42.06,70.88 42.04,70.86 ; 48.98,66.17 52.5,69.69 U62.2
$1N36659: length 32.6
  Top Layer w0.254: D96.1 44.2,44.51 44.2,46.1 45.47,47.37 U59.7 60.44,47.37 61.01,46.81 63.68,46.81 64.9,45.59 66.29,45.59 68.71,43.18 68.71,41.84
$1N37726: length 4.7
  Top Layer w0.254: ESP8266_RHS.6 ESP8266_RHS1.6
$1N37760: length 4.7
  Top Layer w0.254: ESP8266_RHS.10 ESP8266_RHS1.10
$1N37765: length 4.7
  Top Layer w0.254: ESP8266_RHS.11 ESP8266_RHS1.11
$1N37770: length 4.7
  Top Layer w0.254: ESP8266_RHS.12 ESP8266_RHS1.12
$1N37775: length 4.7
  Top Layer w0.254: ESP8266_RHS.13 ESP8266_RHS1.13
$1N37785: length 4.7
  Top Layer w0.254: ESP8266_RHS.15 ESP8266_RHS1.15
$1N37872: length 5.1
  Top Layer w0.254: ESP8266_LHS1.1 ESP8266_LHS.1
$1N37876: length 5.1
  Top Layer w0.254: ESP8266_LHS1.2 ESP8266_LHS.2
$1N37881: length 5.1
  Top Layer w0.254: ESP8266_LHS1.3 ESP8266_LHS.3
$1N37886: length 5.1
  Top Layer w0.254: ESP8266_LHS1.4 ESP8266_LHS.4
$1N37891: length 5.1
  Top Layer w0.254: ESP8266_LHS1.5 ESP8266_LHS.5
$1N37903: length 5.1
  Top Layer w0.254: ESP8266_LHS1.6 ESP8266_LHS.6
$1N37907: length 5.1
  Top Layer w0.254: ESP8266_LHS1.7 ESP8266_LHS.7
$1N37912: length 5.1
  Top Layer w0.254: ESP8266_LHS1.8 ESP8266_LHS.8
$1N37917: length 5.1
  Top Layer w0.254: ESP8266_LHS1.9 ESP8266_LHS.9
$1N37922: length 5.1
  Top Layer w0.254: ESP8266_LHS1.10 ESP8266_LHS.10
$1N37927: length 5.1
  Top Layer w0.254: ESP8266_LHS1.11 ESP8266_LHS.11
$1N37932: length 5.1
  Top Layer w0.254: ESP8266_LHS1.12 ESP8266_LHS.12
$1N37937: length 5.1
  Top Layer w0.254: ESP8266_LHS1.13 ESP8266_LHS.13
$1N38352: length 53.7
  Top Layer w0.254: 86.33,48.75 86.26,48.82 83.58,48.82 83.58,49.39 80.92,52.05 77.87,52.05 75.96,53.96 75.96,56.06
  Top Layer w1.999: U54.2 86.43,69.67 82.91,66.15 ; 75.96,56.06 82.76,56.06 86.51,59.8 86.51,63.23 83.58,66.15 82.91,66.15 ; 75.96,70.84 75.99,70.87 77.71,70.87 79.12,69.45 79.12,67.82 80.54,66.4 82.66,66.4 82.91,66.15

## Copper pours and planes (outline as drawn; the poured copper is in the pictures)
GND on Bottom Layer: -13.59,97.28 213.87,97.28 213.87,-20.07 -13.59,-20.07

## Text on the board
Top Silkscreen Layer: Designed by CBDT / www.topthu.org | CAP / 12V / 5V / GND | 陆 | 伍 | 肆 | 叁 | 六脉神剑 | 贰 | 壹
